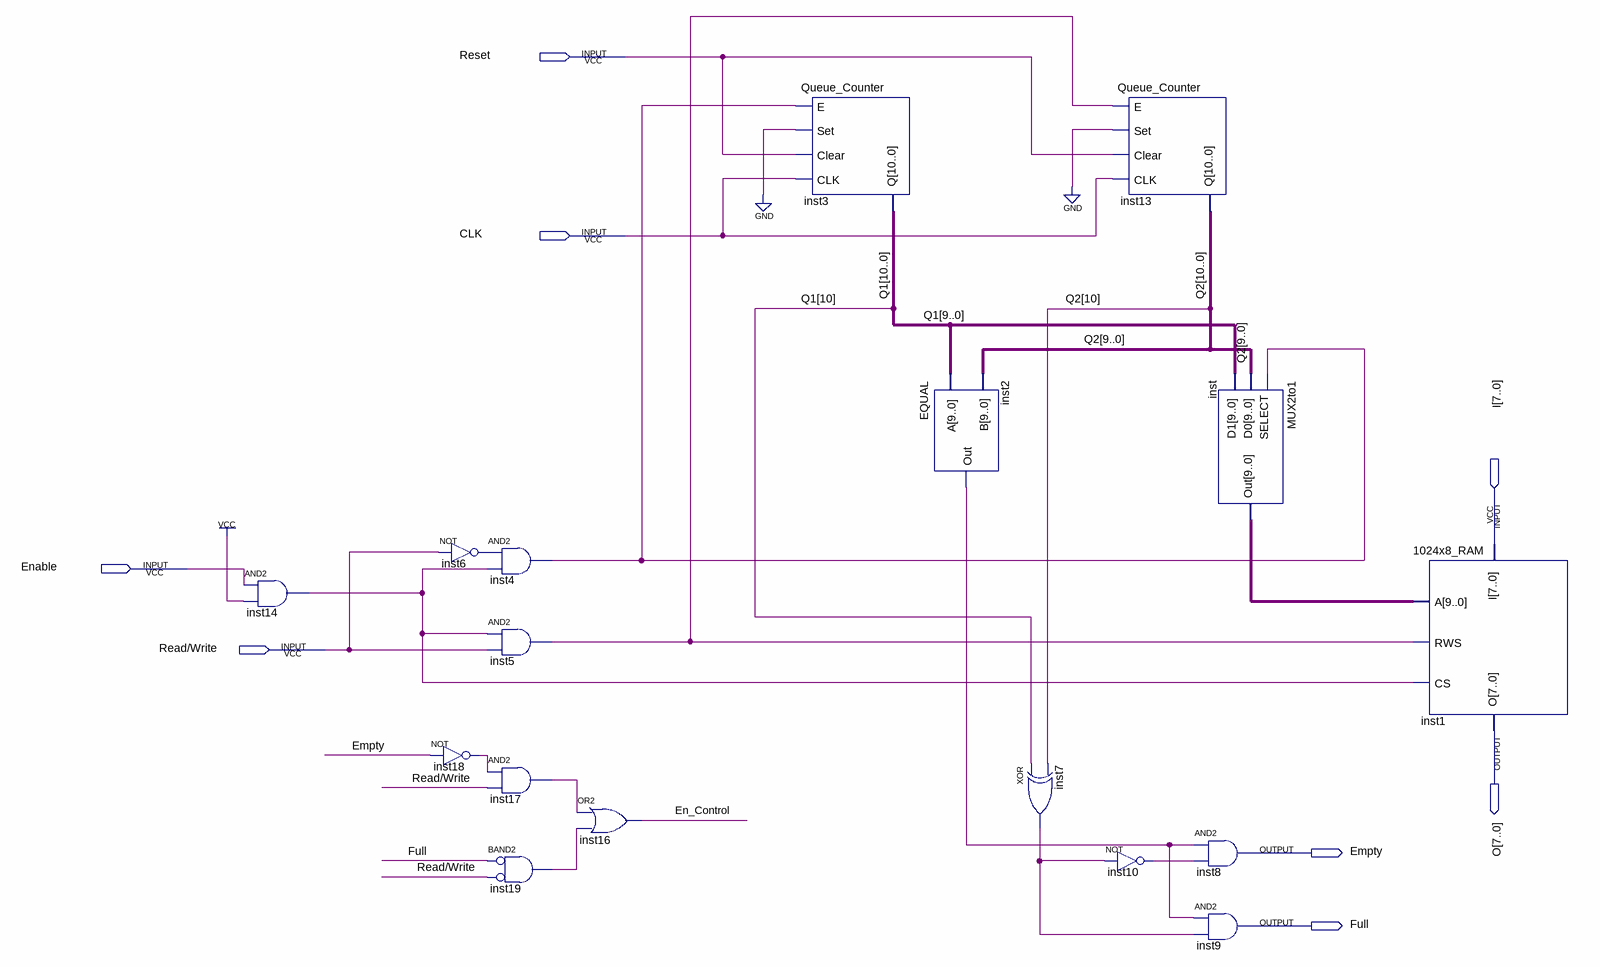
[diagram p0: schematic sheet]
// Quartus schematic TKLLS.bdf as structural Verilog: 17 symbols, 8 pins
module TKLLS (
  input  Reset,
  input  CLK,
  input  [7:0] I,
  input  Enable,
  input  \Read/Write ,
  output [7:0] O,
  output Empty,
  output Full
);

  wire En_Control, inst2_out, inst4_out, inst5_out, inst6_out, inst7_out, inst10_out, inst14_out, inst17_out,
       inst18_out, inst19_out;
  wire [9:0] inst_out;
  wire [10:0] Q1, Q2;

  and inst14 (inst14_out, Enable, 1'b1);
  and inst4 (inst4_out, inst6_out, inst14_out);
  not inst6 (inst6_out, \Read/Write );
  and inst5 (inst5_out, inst14_out, \Read/Write );
  not inst18 (inst18_out, Empty);
  and inst17 (inst17_out, inst18_out, \Read/Write );
  and inst19 (inst19_out, ~Full, ~\Read/Write );  // BAND2
  or inst16 (En_Control, inst17_out, inst19_out);
  Queue_Counter inst3 (.E(inst4_out), .Set(1'b0), .Clear(Reset), .CLK(CLK), .Q(Q1));
  EQUAL inst2 (.A(Q1[9:0]), .B(Q2[9:0]), .Out(inst2_out));
  xor inst7 (inst7_out, Q1[10], Q2[10]);
  Queue_Counter inst13 (.E(inst5_out), .Set(1'b0), .Clear(Reset), .CLK(CLK), .Q(Q2));
  not inst10 (inst10_out, inst7_out);
  MUX2to1 inst (.SELECT(inst4_out), .D0(Q2[9:0]), .D1(Q1[9:0]), .Out(inst_out));
  and inst8 (Empty, inst2_out, inst10_out);
  and inst9 (Full, inst2_out, inst7_out);
  \1024x8_RAM  inst1 (.I(I), .A(inst_out), .RWS(inst5_out), .CS(inst14_out), .O(O));
endmodule
